# EAGLE design ZX_Gesture_Sensor_SMD_v02 (EAGLE 7.5.0)
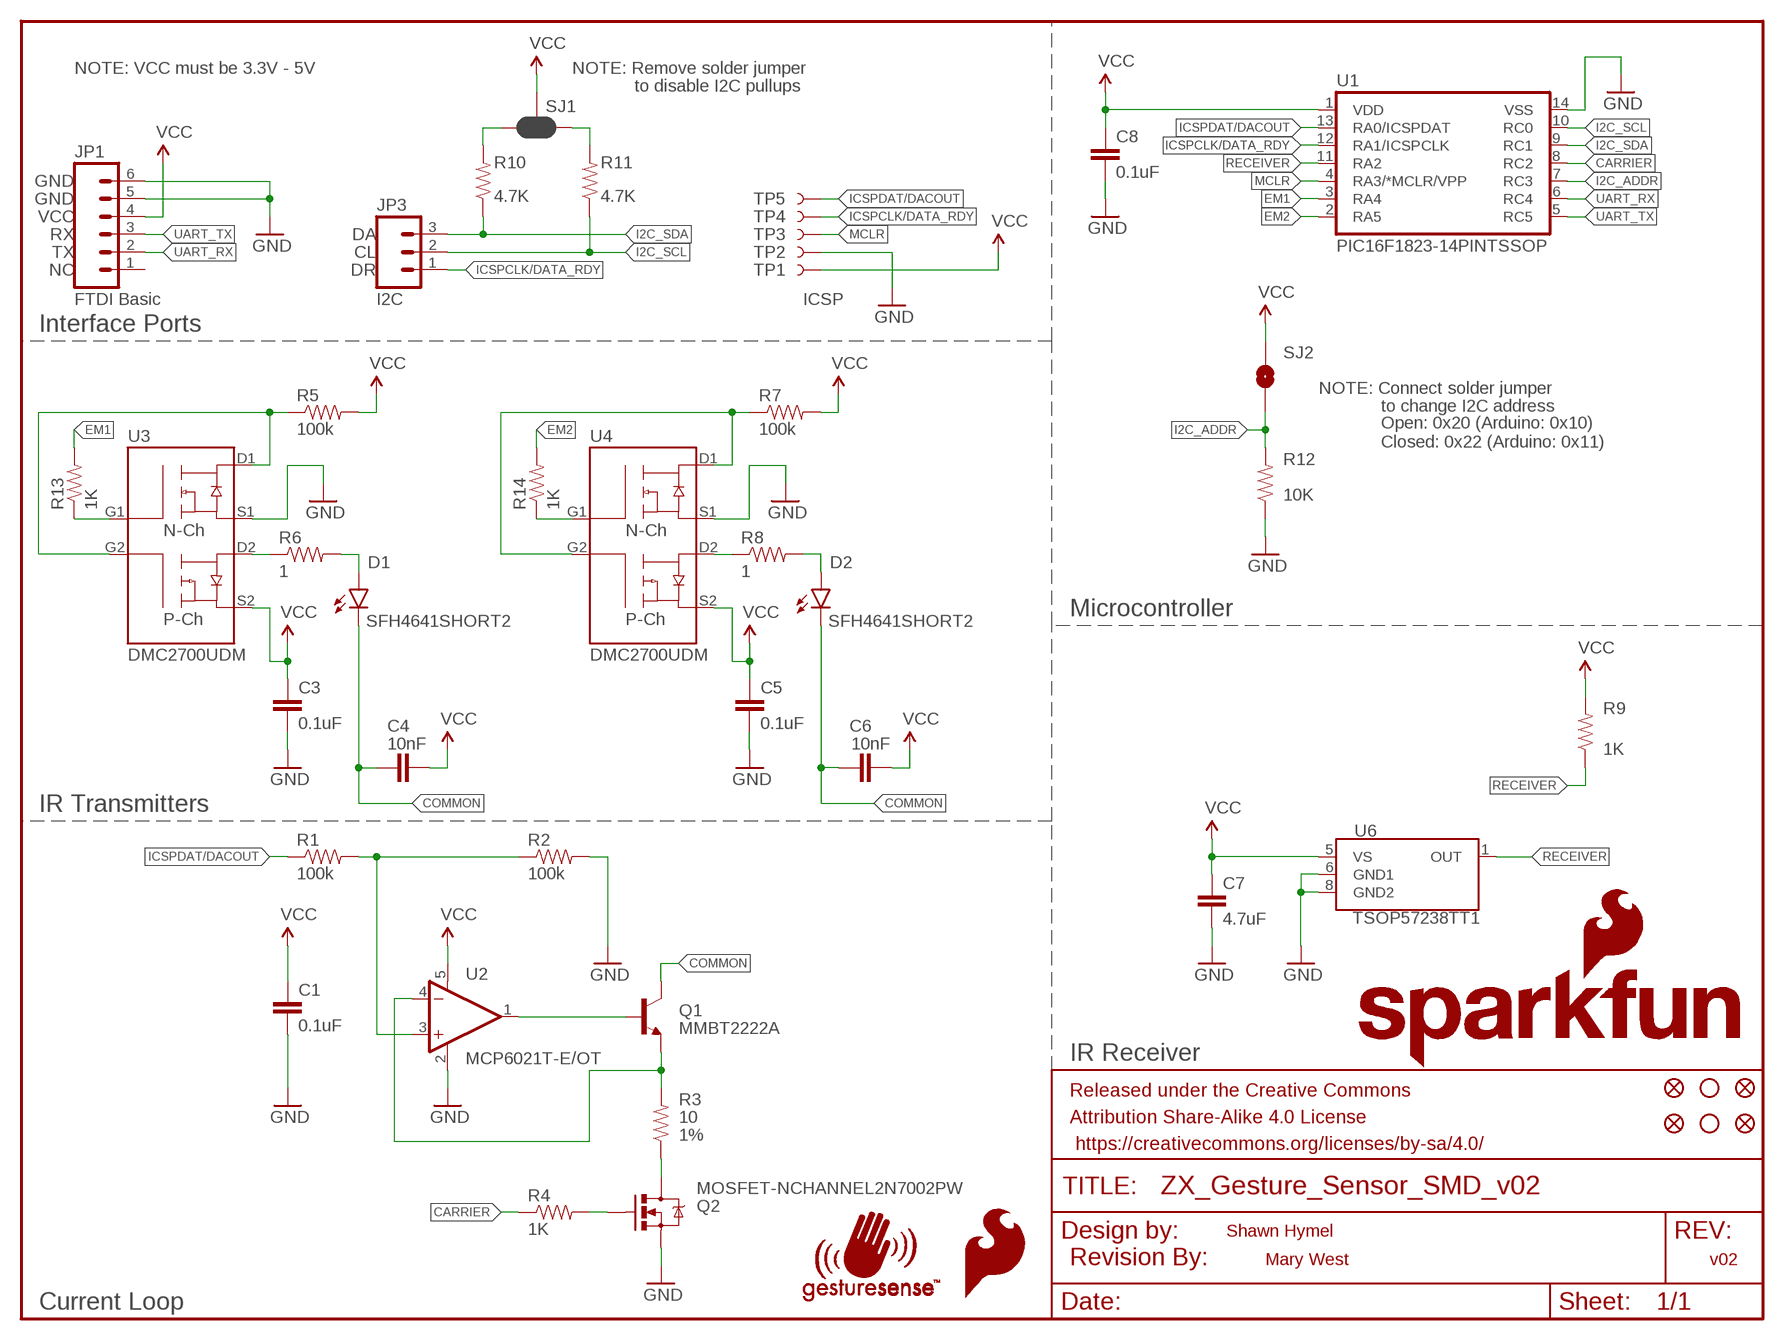
[diagram p0: schematic, sheet 1]

## Parts
C1  0.1uF  0.1UF-25V(+80/-20%)(0603)  [0603-CAP]
C3  0.1uF  0.1UF-25V(+80/-20%)(0603)  [0603-CAP]
C4  10nF  10NF/10000PF-50V-10%(0603)  [0603-CAP]
C5  0.1uF  0.1UF-25V(+80/-20%)(0603)  [0603-CAP]
C6  10nF  10NF/10000PF-50V-10%(0603)  [0603-CAP]
C7  4.7uF  4.7UF-6.3V-10%(0603)0603  [0603-CAP]
C8  0.1uF  0.1UF-25V(+80/-20%)(0603)  [0603-CAP]
D1  SFH4641SHORT2  [SFH4641-SHORT2]
D2  SFH4641SHORT2  [SFH4641-SHORT2]
FID1  FIDUCIALUFIDUCIAL  [MICRO-FIDUCIAL]
FID2  FIDUCIALUFIDUCIAL  [MICRO-FIDUCIAL]
FID3  FIDUCIALUFIDUCIAL  [MICRO-FIDUCIAL]
FID4  FIDUCIALUFIDUCIAL  [MICRO-FIDUCIAL]
FRAME1  FRAME-LETTER  [CREATIVE_COMMONS]
JP1  M06NO_SILK_FEMALE_PTH  [1X06_NO_SILK]
JP3  M031X03_NO_SILK  [1X03_NO_SILK]
LOGO1  REVISION  [REVISION]
LOGO2  SFE_LOGO_FLAME.1_INCH  [SFE_LOGO_FLAME_.1]
Q1  MMBT2222A  TRANSISTOR_NPNMMBT2222A  [SOT23-3]
Q2  MOSFET-NCHANNEL2N7002PW  [SOT323]
R1  100k  100KOHM-1/10W-1%(0603)  [0603-RES]
R2  100k  100KOHM-1/10W-1%(0603)  [0603-RES]
R3  10  10OHM-1/10W-1%(0603)SMD  [0603-RES]
R4  1K  1KOHM-1/10W-1%(0603)  [0603-RES]
R5  100k  100KOHM-1/10W-1%(0603)  [0603-RES]
R6  1  1OHM1/10W1%(0603)  [0603-RES]
R7  100k  100KOHM-1/10W-1%(0603)  [0603-RES]
R8  1  1OHM1/10W1%(0603)  [0603-RES]
R9  1K  1KOHM-1/10W-1%(0603)  [0603-RES]
R10  4.7K  4.7KOHM-1/10W-1%(0603)  [0603-RES]
R11  4.7K  4.7KOHM-1/10W-1%(0603)  [0603-RES]
R12  10K  10KOHM-1/10W-1%(0603)0603  [0603-RES]
R13  1K  1KOHM-1/10W-1%(0603)  [0603-RES]
R14  1K  1KOHM-1/10W-1%(0603)  [0603-RES]
SJ1  JUMPER-PAD-3-NC_BY_PASTE  [PAD-JUMPER-3-NC_BY_PASTE_YES_SILK_FULL_BOX]
SJ2  JUMPER-PAD-2-NOYES_SILK  [PAD-JUMPER-2-NO_YES_SILK]
STANDOFF1  STAND-OFF  [STAND-OFF]
STANDOFF2  STAND-OFF  [STAND-OFF]
TP1  TEST-POINT3X4  [PAD.03X.04]
TP2  TEST-POINT3X4  [PAD.03X.04]
TP3  TEST-POINT3X4  [PAD.03X.04]
TP4  TEST-POINT3X4  [PAD.03X.04]
TP5  TEST-POINT3X4  [PAD.03X.04]
U1  PIC16F1823-14PINTSSOP  [TSSOP14]
U2  MCP6021T-E/OT  [SOT23-5]
U3  DMC2700UDM  [SOT26]
U4  DMC2700UDM  [SOT26]
U6  TSOP57238TT1  [TSOP572]
U$5  SFE_LOGO_NAME_FLAME.1_INCH  [SFE_LOGO_NAME_FLAME_.1]
U$6  GESTURESENSE_LOGOSTEXT  [GESTURESENSE_TEXT]

## Nets
CARRIER: R4.1 U1.8(RC2)
COMMON: C4.1 C6.1 D1.C D2.C Q1.3(C)
EM1: R13.2 U1.3(RA4)
EM2: R14.2 U1.2(RA5)
GND: C1.2 C3.2 C5.2 C7.2 C8.2 JP1.5 JP1.6 Q2.2(S) R2.2 R12.1 TP2.P$1 U1.14(VSS) U2.2(V-) U3.S1 U4.S1 U6.6(GND1) U6.8(GND2)
I2C_ADDR: R12.2 SJ2.1 U1.7(RC3)
I2C_SCL: JP3.2 R11.1 U1.10(RC0)
I2C_SDA: JP3.3 R10.1 U1.9(RC1)
ICSPCLK/DATA_RDY: JP3.1 TP4.P$1 U1.12(RA1/ICSPCLK)
ICSPDAT/DACOUT: R1.1 TP5.P$1 U1.13(RA0/ICSPDAT)
MCLR: TP3.P$1 U1.4(RA3/*MCLR/VPP)
N$1: R1.2 R2.1 U2.3(+IN)
N$2: Q1.2(E) R3.2 U2.4(-IN)
N$3: Q1.1(B) U2.1(OUT)
N$4: Q2.3(D) R3.1
N$5: Q2.1(G) R4.2
N$6: R6.1 U3.D2
N$7: D1.A R6.2
N$8: R5.1 U3.D1 U3.G2
N$9: R7.1 U4.D1 U4.G2
N$10: R10.2 SJ1.3
N$11: R8.1 U4.D2
N$12: D2.A R8.2
N$13: R11.2 SJ1.1
N$15: R13.1 U3.G1
N$19: R14.1 U4.G1
RECEIVER: R9.1 U1.11(RA2) U6.1(OUT)
UART_RX: JP1.2 U1.6(RC4)
UART_TX: JP1.3 U1.5(RC5)
VCC: C1.1 C3.1 C4.2 C5.1 C6.2 C7.1 C8.1 JP1.4 R5.2 R7.2 R9.2 SJ1.2 SJ2.2 TP1.P$1 U1.1(VDD) U2.5(V+) U3.S2 U4.S2 U6.5(VS)
Unconnected: JP1.1

## Notes on the sheet
- NOTE: VCC must be 3.3V - 5V | NOTE: Remove solder jumper
- to disable I2C pullups
- GND
- GND
- VCC
- RX | DA
- TX | CL
- NC | DR
- FTDI Basic | I2C | ICSP
- Interface Ports
- NOTE: Connect solder jumper
- to change I2C address
- Open: 0x20 (Arduino: 0x10)
  Closed: 0x22 (Arduino: 0x11)
- Microcontroller
- IR Transmitters
- IR Receiver
- Shawn Hymel
- Mary West | v02
- Current Loop

## Library data of the parts
C1 C3 C5 C8 = SparkFun-Capacitors:0.1UF-25V(+80/-20%)(0603): CAP-00810 Ceramic Standard decoupling cap; PROD_ID: CAP-00810
C4 C6 = SparkFun-Capacitors:10NF/10000PF-50V-10%(0603): CAP-00867; PROD_ID: CAP-00867
C7 = SparkFun-Capacitors:4.7UF-6.3V-10%(0603): CAP-08280; PROD_ID: CAP-08280
D1 D2 = SparkFun-LED:SFH4641; PROD_ID: DIO-11994
FID1-FID4 = SparkFun-Aesthetics:FIDUCIAL: Fiducial Alignment Points Various fiducial points for machine vision alignment.
FRAME1 = SparkFun-Aesthetics:FRAME-LETTER: Schematic Frame Standard 8.5x11 US Letter frame
JP1 = SparkFun-Connectors:M06: Header 6 Standard 6-pin 0.1" header. Use with straight break away headers (SKU : PRT-00116), right angle break away headers (PRT-00553), swiss pins (PRT-00743), machine pins (PRT-00117), and female headers (PRT-00115). Molex polarized connector foot print use with SKU : PRT-08094 with associated crimp pins and housings. NOTES ON THE VARIANTS LOCK and LOCK_LONGPADS... This footprint was designed to help hold the alignment of a through-hole component (i.e. 6-pin header) while soldering it into place. You may notice that each hole has been shifted either up or down by 0.005 of an inch from it's more standard position (which is a perfectly straight line). This slight alteration caused the pins (the squares in the middle) to touch the edges of the holes. Because they are alternating, it causes a "brace" to hold the component in place. 0.005 has proven to be the perfect amount of "off-center" position when using our standard breakaway headers. Although looks a little odd when you look at the bare footprint, once you have a header in there, the alteration is very hard to notice. Also,if you push a header all the way into place, it is covered up entirely on the bottom side. This idea of altering the position of holes to aid alignment will be further integrated into the Sparkfun Library for other footprints. It can help hold any component with 3 or more connection pins.; PROD_ID: CONN-08437
JP3 = SparkFun-Connectors:M03: Header 3 Standard 3-pin 0.1" header. Use with straight break away headers (SKU : PRT-00116), right angle break away headers (PRT-00553), swiss pins (PRT-00743), machine pins (PRT-00117), and female headers (PRT-00115). Molex polarized connector foot print use with SKU : PRT-08232 with associated crimp pins and housings.
LOGO1 = SparkFun-Aesthetics:REVISION
LOGO2 = SparkFun-Aesthetics:SFE_LOGO_FLAME: SFE Logo, flame only This is the SparkFun flame logo. The logo on the schematic will always be the same size; the package variant is the height of the flame. Default layer for the logo on the board is tSilk.
Q1 = SparkFun-DiscreteSemi:TRANSISTOR_NPN: Generic NPN BJT MMBT2222A - TRANS-08049 (SOT-23, 1A 40V) MPSA42 - TRANS-09116 (SOT-23, 500mA 300V) MMBT5088LT1G - TRANS-11160 (SOT-23, 50 mA 30V) BC547 - COM-08928 <http://www.sparkfun.com/products/8928> (TO-92 45V 100mA) (1.Collector 2.Base 3.Emitter) 2N3904 - COM-00521 <http://www.sparkfun.com/products/521> (TO-92 40V 200mA) (1.Emitter 2.Base 3.Collector) P2N2222A - COM-12852 <http://www.sparkfun.com/products/12852> (TO-92 40V 600mA) (1.Collector 2.Base 3.Emitter); PROD_ID: TRANS-08049
Q2 = SparkFun-DiscreteSemi:MOSFET-NCHANNEL: Common NMOSFET Parts MFG P/N Store ID Prod ID FDD8780 TRANS-09984 SI7820DN TRANS-11055 FDS6630A IC-08089 2N7002PW TRANS-11151 FQP30N06L COM-10213 TRANS-10060 BSS123LT1G TRANS-08345 BSS138 TRANS-00830 BS170 2N7000; PROD_ID: TRANS-11151
R1 R2 R5 R7 = SparkFun-Resistors:100KOHM-1/10W-1%(0603): RES-07828; PROD_ID: RES-07828
R3 = SparkFun-Resistors:10OHM-1/10W-1%(0603): RES-12581; PROD_ID: RES-12581; TOL: 1%
R4 R9 R13 R14 = SparkFun-Resistors:1KOHM-1/10W-1%(0603): RES-07856; PROD_ID: RES-07856
R6 R8 = SparkFun-Resistors:1OHM1/10W1%(0603): RES-08269; PROD_ID: RES-08269
R10 R11 = SparkFun-Resistors:4.7KOHM-1/10W-1%(0603): RES-07857; PROD_ID: RES-07857
R12 = SparkFun-Resistors:10KOHM-1/10W-1%(0603): RES-00824; PROD_ID: RES-00824
SJ1 = SparkFun-Passives:JUMPER-PAD-3-NC_BY_PASTE
SJ2 = SparkFun-Passives:JUMPER-PAD-2-NO
STANDOFF1 STANDOFF2 = SparkFun-Electromechanical:STAND-OFF: #4 Stand Off This is the mechanical footprint for a #4 phillips button head screw. Use the keepout ring to avoid running the screw head into surrounding components. SKU : PRT-00447
TP1-TP5 = SparkFun-Passives:TEST-POINT: Bare copper test points for troubleshooting or ICT
U1 = SparkFun-DigitalIC:PIC16F1823-14PIN; PROD_ID: IC-11992
U2 = SparkFun-AnalogIC:MCP6021: Rail-to-rail input/output op-amp with 10 MHz bandwidth.; PROD_ID: IC-12504
U3 U4 = SparkFun-DiscreteSemi:DMC2700UDM; PROD_ID: TRANS-11993
U6 = SparkFun-Sensors:TSOP57238TT1; PROD_ID: COMP-11990
U$5 = SparkFun-Aesthetics:SFE_LOGO_NAME_FLAME: SFE Logo, name and flame This is the SparkFun full logo. The logo on the schematic will always be the same size; the package variant is the height of the flame part of the logo. Default layer for the logo on the board is tSilk.
U$6 = SparkFun-Aesthetics:GESTURESENSE_LOGOS

## Board
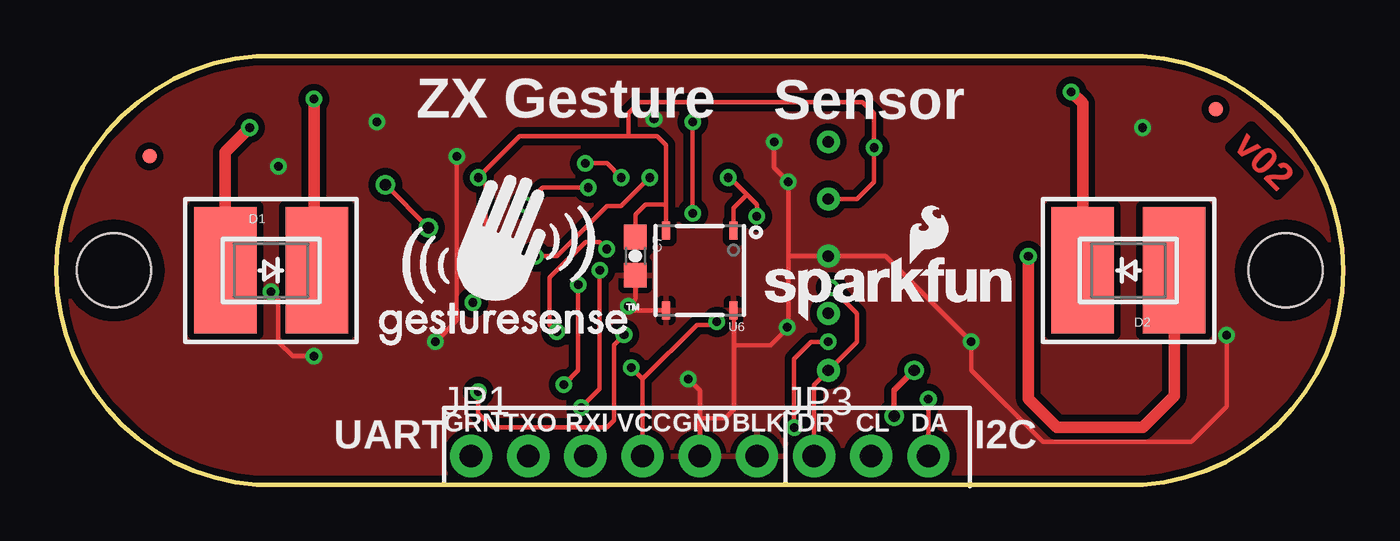
[diagram p1: board, top side]
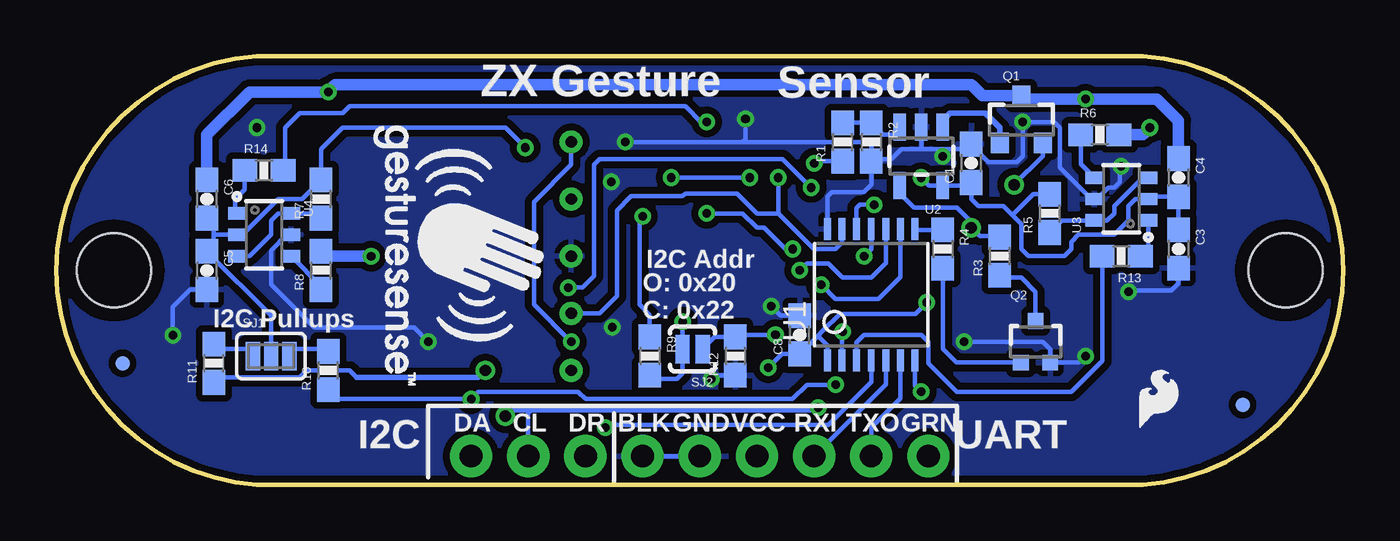
[diagram p2: board, bottom side, seen from below]

Size 57.19 x 19.05 mm. Coordinates in mm from the lower left corner, seen from the top.
Outline: 8.91,19.05 48.28,19.05 arc-172 48.28,0 8.91,0 arc-172 8.91,19.05
Copper layers (1*16): Top 0.035mm / dielectric 1.5mm / Bottom 0.035mm
Design rules "SparkFun-2-layer-TIGHT": minimum track width 7mil, minimum drill 15mil, track to track 7mil, track to pad 7mil, pad to pad 7mil, via to via 7mil, smd to smd 7mil, copper to edge 7mil, drill to drill 7mil, minimum pad ring 7mil, minimum via ring 7mil, stop-mask expansion 4mil, vias tented up to drill 20mil, thermal gap 10mil

### Footprints (pad centres in the part's own frame; a part is rotated, then mirrored left to right if it is on the bottom)
0603-CAP = smd 1.1 x 1: 1 -0.85,0; 2 0.85,0
SFH4641-SHORT2 = smd 5.62 x 2.77: A 0,-2.035; C 0,2.035
MICRO-FIDUCIAL = smd 0.635 x 0.635: 1 0,0
1X06_NO_SILK = drill 1.016 pad 1.88: 1 0,0; 2 2.54,0; 3 5.08,0; 4 7.62,0; 5 10.16,0; 6 12.7,0
1X03_NO_SILK = drill 1.016 pad 1.88: 1 0,0; 2 2.54,0; 3 5.08,0
SOT23-3 = smd 0.8 x 0.9: 1 -0.95,-1; 2 0.95,-1; 3 0,1.1
SOT323 = smd 0.7 x 0.7: 1 -0.65,-0.925; 2 0.65,-0.925; 3 0,0.925
0603-RES = smd 1.1 x 1: 1 -0.85,0; 2 0.85,0
PAD-JUMPER-3-NC_BY_PASTE_YES_SILK_FULL_BOX = smd 0.635 x 1.27: 1 -0.813,0; 2 0,0; 3 0.813,0
PAD-JUMPER-2-NO_YES_SILK = smd 0.635 x 1.27: 1 -0.45,0; 2 0.45,0
STAND-OFF = hole 3.302: 0,0
PAD.03X.04 = smd 1.016 x 1.016: P$1 0,0
TSSOP14 = smd 0.305 x 0.991: 1 -1.95,-2.918; 2 -1.3,-2.918; 3 -0.65,-2.918; 4 0,-2.918; 5 0.65,-2.918; 6 1.3,-2.918; 7 1.95,-2.918; 8 1.95,2.918; 9 1.3,2.918; 10 0.65,2.918; 11 0,2.918; 12 -0.65,2.918; 13 -1.3,2.918; 14 -1.95,2.918
SOT23-5 = smd 0.55 x 1.2: 1 -0.95,-1.3; 2 0,-1.3; 3 0.95,-1.3; 4 0.95,1.3; 5 -0.95,1.3
SOT26 = smd 0.55 x 0.8: D1 -0.95,1.2; D2 0.95,1.2; G1 -0.95,-1.2; G2 0.95,-1.2; S1 0,1.2; S2 0,-1.2
TSOP572 = smd 0.35 x 0.8: 1 -1.5,-1.775; 5 1.5,-1.775; 6 1.5,1.775; 8 -1.5,1.775

### Placement (x,y rotation side)
C1  16.53,14.29 90 bottom
C3  7.32,10.48 270 bottom
C4  7.32,13.65 270 bottom
C5  50.5,9.53 270 bottom
C6  50.5,12.7 270 bottom
C7  25.74,10.16 270 top
C8  24.15,6.67 90 bottom
D1  9.55,9.53 270 top
D2  47.65,9.53 90 top
FID1  4.47,3.56 0 bottom
FID2  54.25,5.4 0 bottom
FID3  4.15,14.61 0 top
FID4  51.52,16.7 0 top
FRAME1  -4.74,-8.57 0 top  (outside the outline)
JP1  18.44,1.27 0 top
JP3  33.68,1.27 0 top
LOGO1  26.37,-14.92 180 top  (outside the outline)
LOGO2  9.36,2.2 0 bottom
Q1  14.31,16.19 0 bottom
Q2  13.67,6.35 0 bottom
R1  22.25,15.24 90 bottom
R2  20.98,15.24 270 bottom
R3  15.26,10.16 90 bottom
R4  17.8,10.48 270 bottom
R5  13.04,12.06 90 bottom
R6  10.82,15.56 0 bottom
R7  45.42,12.7 90 bottom
R8  45.42,9.53 90 bottom
R9  30.82,5.71 270 bottom
R10  45.11,5.08 90 bottom
R11  50.19,5.4 90 bottom
R12  27.01,5.71 90 bottom
R13  9.86,10.16 180 bottom
R14  47.96,13.97 0 bottom
SJ1  47.65,5.71 0 bottom
SJ2  28.91,6.03 180 bottom
STANDOFF1  2.56,9.53 0 top
STANDOFF2  54.63,9.53 90 top
TP1  34.31,12.7 90 bottom
TP2  34.31,10.16 0 bottom
TP3  34.31,15.24 0 bottom
TP4  34.31,5.08 0 bottom
TP5  34.31,7.62 0 bottom
U1  20.98,8.45 0 bottom
U2  18.75,14.61 180 bottom
U3  9.86,12.7 90 bottom
U4  47.96,11.11 270 bottom
U6  28.6,9.53 180 top
U$1  GESTURESENSE_LOGOSTEXT  [GESTURESENSE_TEXT]  43.07,15.94 270 bottom
U$5  31.09,7.2 0 top
U$6  14.37,6.22 0 top

### Tracks (layer width: path | path; a pad name or v marks a point on that pad's centre or on a via)
CARRIER
  Bottom 0.203: R4.1 18.99,11.33 U1.8
COMMON  (via drill 0.38)
  Top 0.203: 11.45,9.53 D1.C
  Top 0.508: 11.45,9.53 v11.45,17.14 | D2.C 45.61,16.96 v45.11,17.46
  Bottom 0.203: 14.16,17.14 Q1.3
  Bottom 0.508: C4.1 7.32,16.19 8.28,17.14 v11.45,17.14 14.16,17.14 | C6.1 50.5,15.56 48.6,17.46 v45.11,17.46 44.79,17.78 16.53,17.78 16.04,17.29 Q1.3
EM1
  Bottom 0.203: R13.2 10.71,5.5 12.09,4.13 17.17,4.13 18.44,5.4 18.44,6.35 18.75,6.67 21.29,6.67 21.63,6.33 U1.3
EM2  (via drill 0.38)
  Top 0.203: v24.47,10.48 24.15,10.79 23.52,10.79 21.93,9.21 21.93,7.11 v22.25,6.79 | v28.28,16.13 v28.28,12.06
  Bottom 0.203: R14.2 47.01,14.07 47.01,15.88 46.38,16.51 44.47,16.51 44.15,16.83 29.23,16.83 28.53,16.13 v28.28,16.13 | v24.47,10.48 24.79,10.48 25.74,11.43 26.06,11.43 26.69,12.06 v28.28,12.06 | U1.2 22.28,6.76 v22.25,6.79
GND  (via drill 0.38, 0.51 pad 1.02)
  Top 0.203: v11.45,5.71 10.5,5.71 9.86,6.35 9.86,8.26 v9.55,8.57 | v16.85,6.35 17.8,7.3 v17.8,14.61 | C7.2 25.74,8.26 v25.42,7.94 25.61,7.75 U6.6 | JP1.5 28.6,2.95 | 28.6,2.95 28.6,4.19 v28.09,4.7 | 30.12,6.22 30.12,7.73 U6.8 | 32.53,10.16 TP2.P$1 36.85,10.16 v40.66,6.35 40.66,5.08 43.84,1.91 50.44,1.91 52.02,3.48 v52.02,6.66 | 30.12,7.77 U6.8 | U6.8 30.1,8.03 | v31.9,15.24 31.9,14.1 v32.53,13.46 32.53,10.16 | 32.53,10.16 32.53,6.99 | 32.53,6.99 31.75,6.2 30.15,6.2 30.12,6.22 | 30.12,6.22 30.12,3.35 29.71,2.95 28.6,2.95 | 32.53,6.99 32.51,6.99 v32.48,7.01
  Bottom 0.203: 17.8,14.92 16.75,14.92 C1.2 16.53,15.11 15.77,14.35 14.5,14.35 14.25,14.61 v14.25,16.13 12.85,16.13 12.59,15.88 12.59,14.1 11.2,12.7 U3.S1 10.94,12.7 10.44,13.21 10.18,13.21 9.93,13.46 9.93,14.1 v9.86,14.16 | v16.85,6.35 13.36,6.35 13.02,6.02 Q2.2 11.74,5.42 v11.45,5.71 | 17.8,14.92 v17.8,14.61 | JP1.6 JP1.5 | C8.2 25,7.52 v25.42,7.94 | R2.2 20.98,13.34 21.29,13.02 22.72,13.02 22.93,12.81 U1.14 | 17.8,14.92 18.82,14.92 | 18.82,14.92 19.64,14.92 20.09,14.48 20.89,14.48 R2.2 | U2.2 18.75,14.99 18.82,14.92 | C3.2 7.32,8.95 7.64,8.64 9.48,8.64 v9.55,8.57 | R12.1 27.92,4.87 v28.09,4.7 | R2.2 20.98,15.11 21.1,15.24 26.69,15.24 | 26.69,15.24 v31.9,15.24 | v26.56,16.26 26.56,15.37 26.69,15.24 | U4.S1 46.95,11.11 47.65,10.41 47.65,8.89 45.74,6.99 41.3,6.99 v40.66,6.35 | C5.2 51.24,8.68 52.02,7.9 v52.02,6.66
  other vias: 34.31,10.16 48.28,15.88
  pour Bottom (isolate 0.305): 0.02,12.7 6.37,19.05 50.82,19.05 57.17,12.7 57.17,6.35 50.82,0 6.37,0 0.02,6.35
  pour Top (isolate 0.305): 6.37,0 50.82,0 57.17,6.35 57.17,11.43 57.17,12.7 50.82,19.05 7.64,19.05 6.37,19.05 0.02,12.7 0.02,6.35
I2C_ADDR  (via drill 0.38)
  Top 0.203: v18.75,4.13 18.75,3.17 19.39,2.54 24.47,2.54 24.79,2.86 24.79,6.22 v25.23,6.67
  Bottom 0.203: v25.23,6.67 27.01,6.67 R12.2 27.93,6.57 SJ2.1 | U1.7 19.03,4.4 v18.75,4.13
I2C_SCL  (via drill 0.38, 0.51)
  Top 0.203: v24.15,9.53 24.15,4.25 v23.33,3.43
  Top 0.254: v37.23,3.05 37.23,4.19 v38.12,5.08
  Bottom 0.203: 43.84,4.76 44.15,5.08 46.06,5.08 46.38,4.76 49.97,4.76 R11.1 | v24.15,9.53 23.83,9.84 22.88,9.84 22.25,9.21 20.98,9.21 20.33,9.86 U1.10 | 36.09,3.3 36.98,3.3 v37.23,3.05 | JP3.2 36.22,3.17 36.09,3.3 | 36.09,3.3 23.45,3.3 v23.33,3.43
  Bottom 0.254: 43.84,4.76 38.44,4.76 v38.12,5.08
I2C_SDA  (via drill 0.38)
  Top 0.203: JP3.3 v38.76,3.81 | v23.2,8.89 23.2,5.08 v22.56,4.45
  Bottom 0.203: R10.1 45.11,3.81 v38.76,3.81 38.44,4.13 33.99,4.13 33.68,3.81 24.47,3.81 23.83,4.45 v22.56,4.45 | U1.9 19.68,9.24 20.66,8.26 22.56,8.26 v23.2,8.89
ICSPCLK/DATA_RDY  (via drill 0.38, 0.51 pad 1.02)
  Top 0.203: v20.85,12.45 21.61,13.21 v23.64,13.21 | JP3.1 33.68,4.45 TP4.P$1 35.58,6.35 35.58,7.62 v34.44,8.76
  Bottom 0.203: v23.64,13.21 24.91,14.48 33.04,14.48 33.3,14.22 33.3,9.27 33.8,8.76 v34.44,8.76 | U1.12 21.63,12.3 21.48,12.45 v20.85,12.45
  other vias: 34.31,5.08
ICSPDAT/DACOUT  (via drill 0.38, 0.51 pad 1.02)
  Top 0.203: v23.52,14.29 24.47,14.29 v25.1,13.65
  Bottom 0.203: R1.1 23.41,14.39 v23.52,14.29 | 25.1,12.06 23.52,10.48 22.56,10.48 22.28,10.77 U1.13 | v25.1,13.65 25.1,12.06 | 25.1,12.06 26.06,12.06 26.95,12.95 29.23,12.95 29.36,12.83 31.64,12.83 32.28,12.19 32.28,8.38 33.04,7.62 TP5.P$1
  other vias: 34.31,7.62
MCLR  (via drill 0.38, 0.51 pad 1.02)
  Top 0.203: v34.31,6.35 33.55,6.35 32.79,5.59 v32.79,2.54
  Bottom 0.203: U1.4 20.98,4.57 22.88,2.67 32.66,2.67 v32.79,2.54 | TP3.P$1 34.31,14.22 35.96,12.57 35.96,8 v34.31,6.35
  other vias: 34.31,15.24
N$1
  Bottom 0.203: R1.2 R2.1 20.45,15.56 19.7,15.56
  Bottom 0.254: U2.3 19.7,15.56
N$2  (via drill 0.51)
  Top 0.203: v14.63,13.34 v16.53,11.43
  Bottom 0.203: U2.4 19.7,12.95 19.07,12.32 17.17,12.32 16.53,11.68 v16.53,11.43 16.15,11.05 15.3,11.05 R3.2 15.26,11.43 | v14.63,13.34 13.36,14.61 Q1.2
N$3
  Bottom 0.254: Q1.1 15.26,15.87 15.9,16.51 17.48,16.51 17.8,16.19 U2.1
N$4
  Bottom 0.203: Q2.3 13.67,8.57 14.31,9.21 15.16,9.21 R3.1
N$5
  Bottom 0.203: Q2.1 17.19,5.42 17.8,6.03 R4.2
N$6
  Bottom 0.203: R6.1 11.67,14.25 U3.D2
N$7  (via drill 0.38)
  Top 0.508: v8.59,15.88 7.51,14.79 D1.A
  Bottom 0.254: R6.2 9.97,15.34 9.86,15.24
  Bottom 0.508: R6.2 8.91,15.56 v8.59,15.88
N$8
  Bottom 0.203: U3.G2 8.91,13.65 10.18,12.38 10.18,12.06 10.5,11.75 U3.D1 | U3.D1 | U3.D1 12.51,11.75 R5.1
N$9
  Bottom 0.203: R7.1 45.42,12.06 U4.D1 47.33,12.06 47.65,11.75 47.65,11.11 48.6,10.16 U4.G2
N$10
  Bottom 0.203: R10.2 45.11,6.03 46.69,6.03 47.01,5.71 SJ1.3
N$11
  Bottom 0.203: R8.1 45.42,8.82 U4.D2
N$12  (via drill 0.38)
  Top 0.508: D2.A 49.68,3.94 48.28,2.54 44.47,2.54 43.2,3.81 v43.2,10.16
  Bottom 0.203: 45.21,10.16 R8.2
  Bottom 0.508: v43.2,10.16 45.21,10.16
N$13
  Bottom 0.203: SJ1.1 48.6,5.71 48.6,6.03 50.19,6.03 R11.2
N$15
  Bottom 0.203: U3.G1 8.66,10.51 R13.1
N$19
  Bottom 0.203: R14.1 48.81,13.12 49.23,12.7 49.23,12.13 U4.G1
RECEIVER  (via drill 0.38)
  Top 0.203: v21.29,10.16 22.25,10.16 24.47,12.38 25.1,12.38 v26.37,13.65 | v29.87,13.65 29.93,13.65 30.69,12.89 | 30.69,12.89 31.14,12.45 v31.14,11.94 | U6.1 30.1,12.29 30.69,12.89
  Bottom 0.203: v29.87,13.65 v26.37,13.65 | v21.29,10.16 20.98,10.48 U1.11 | R9.1 30.82,7.56 31.26,8 31.26,11.81 v31.14,11.94
UART_RX
  Bottom 0.203: U1.6 19.68,3.84 20.98,2.54 JP1.2
UART_TX
  Bottom 0.203: U1.5 20.33,4.46 JP1.3
VCC  (via drill 0.38, 0.51 pad 1.02)
  Top 0.203: 25.84,11.11 C7.1 25.74,12 26.18,12.45 27.1,12.45 | U6.5 27.1,12.45 | 27.1,12.45 27.1,15.09 26.69,15.49 25.42,15.49 | 25.42,15.49 20.6,15.49 v18.75,13.65 19.07,13.34 19.07,8.66 v18.51,8.1 | TP1.P$1 35.58,12.7 36.34,13.46 v36.34,14.99 36.34,16.51 35.84,17.02 25.93,17.02 25.42,16.51 25.42,15.49 | JP1.4 26.06,4.7 | 26.06,4.7 v25.55,5.21 | 26.06,4.7 28.47,7.11 29.23,7.11 v29.36,7.24
  Bottom 0.203: C5.1 50.5,10.48 | C3.1 C4.2 8.56,12.8 U3.S2 9.23,12.7 9.55,12.38 9.55,11.75 10.18,11.11 11.77,11.11 12.09,10.79 12.09,10.48 12.4,10.16 13.99,10.16 14.31,10.48 14.31,11.6 14.7,11.99 | C1.1 16.53,13.34 | C6.2 50.5,11.43 50.19,11.43 50.19,11.05 | SJ1.2 47.65,7.52 C5.1 | C1.1 16.66,13.3 U2.5 18.41,13.3 v18.75,13.65 | C1.1 16.53,12.7 16.21,12.38 16.2,12.39 15.11,12.39 14.7,11.99 | 50.19,11.05 50.19,10.69 C5.1 | 50.19,11.05 50.12,11.11 U4.S2 48.92,11.11 47.33,12.7 46.27,12.7 R7.2 45.42,14.92 44.47,15.88 37.23,15.88 v36.34,14.99 | C8.1 24.94,5.82 v25.55,5.21 | v29.36,7.24 29.36,6.86 29.36,6.85 SJ2.2 29.36,4.95 29.61,4.7 30.65,4.7 R9.2 | v18.51,8.1 19.02,7.59 22.37,7.59 23.13,6.83 23.14,6.83 23.35,6.62 | C8.1 24.15,5.84 | 23.35,6.62 C8.1 | U1.1 22.93,6.19 23.35,6.62 | R5.2 13.78,12.91 14.7,11.99
  other vias: 34.31,12.7

### Text on the board
Top: v02
tPlace: ZX Gesture | Sensor | UART | GRN | TXO | RXI | VCC | GND | BLK | DR | CL | DA | I2C
bPlace: Sensor | ZX Gesture | I2C Addr | O: 0x20 / C: 0x22 | I2C Pullups | UART | GRN | TXO | RXI | VCC | GND | BLK | DR | CL | DA | I2C
Measures: All Units Inches
tDocu: Shawn Hymel (SparkFun Electronics) / with XYZ Interactive Technologies | Mary West